# EasyEDA schematic 机创主控拓展板.json
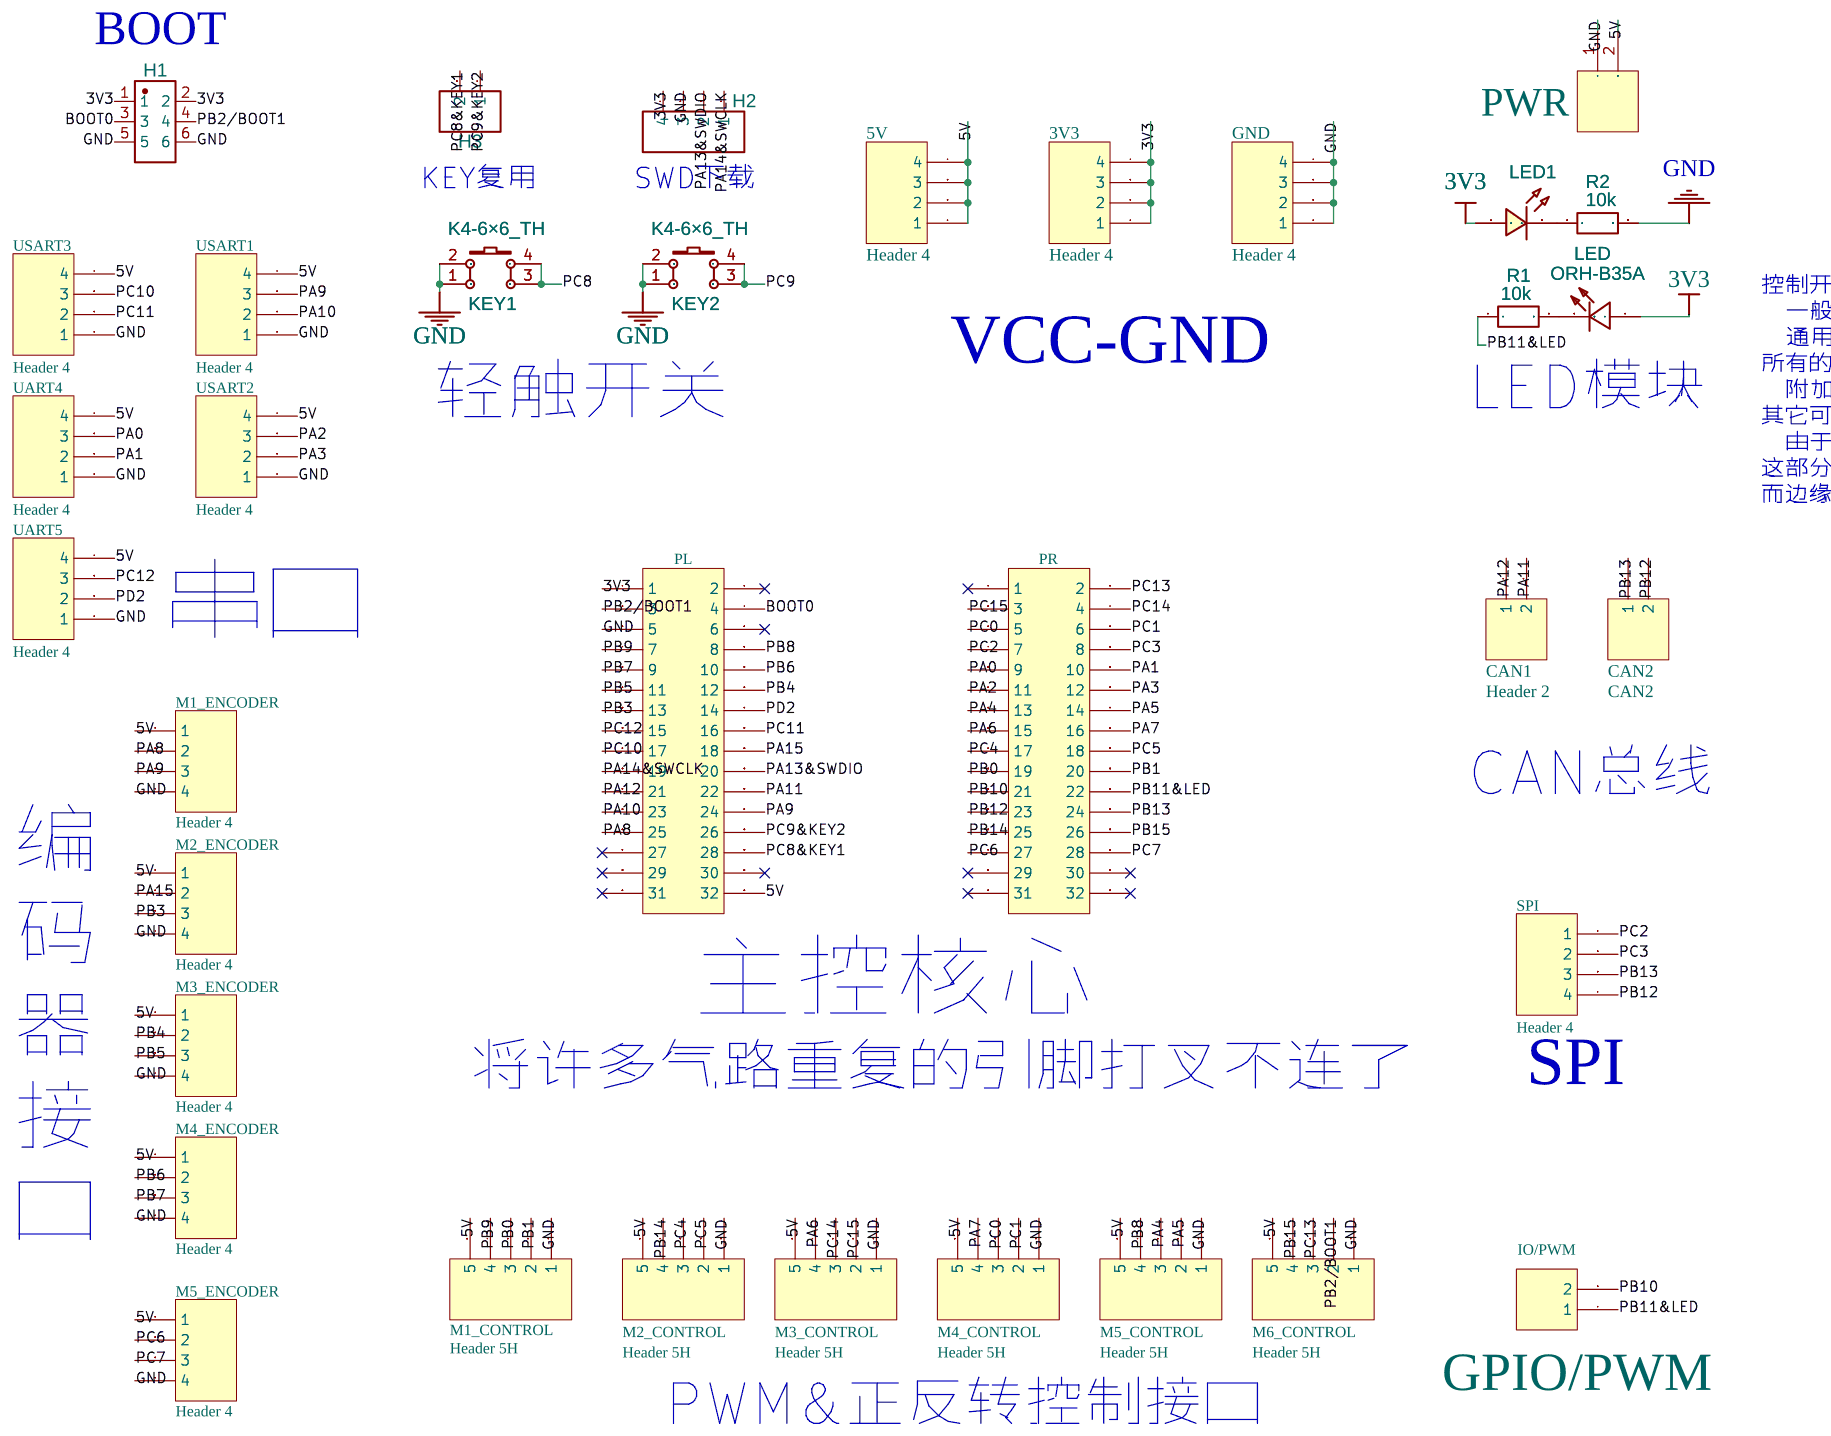
[diagram p0: schematic sheet]

## Parts
3V3  Header 4  [HDR1X4]
5V  Header 4  [HDR1X4]
CAN1  Header 2  [HDR1X2]
CAN2  CAN2  [HDR1X2]
GND  Header 4  [HDR1X4]
H1  PB2为BOOT1设计使用  [HDR-SMD_6P-P2.54-V-M-R2-C3-S2.54-LS7.4]
H2  HDR-F-2.54_1x4  [卧式排针排座]
H3  HDR-F-2.54_1x2  [HDR-F-2.54_1X2]
IO/PWM  GPIO/PWM  [HDR1X2]
KEY1  K4-6×6_TH  [KEY-TH_4P-L6.0-W6.0-P4.50-LS6.5]
KEY2  K4-6×6_TH  [KEY-TH_4P-L6.0-W6.0-P4.50-LS6.5]
LED  ORH-B35A  [LED0805-R-RD]
LED1  LED-0805_R  [LED0805_RED]
M1_CONTROL  Header 5H  [CONN-TH_5P-P2.50_X8821WR-05S-N0SN]
M1_ENCODER  Header 4  [XH2.54-4PW]
M2_CONTROL  Header 5H  [CONN-TH_5P-P2.50_X8821WR-05S-N0SN]
M2_ENCODER  Header 4  [XH2.54-4PW]
M3_CONTROL  Header 5H  [CONN-TH_5P-P2.50_X8821WR-05S-N0SN]
M3_ENCODER  Header 4  [XH2.54-4PW]
M4_CONTROL  Header 5H  [CONN-TH_5P-P2.50_X8821WR-05S-N0SN]
M4_ENCODER  Header 4  [XH2.54-4PW]
M5_CONTROL  Header 5H  [CONN-TH_5P-P2.50_X8821WR-05S-N0SN]
M5_ENCODER  Header 4  [XH2.54-4PW]
M6_CONTROL  Header 5H  [CONN-TH_5P-P2.50_X8821WR-05S-N0SN]
PL  Header 16X2  [HDR2X16]
PR  Header 16X2  [HDR2X16]
PWR  HEADER 2  [CONN-TH_2P-P2.5_XH2.54-2P_H]
R1  10k  [R0805]
R2  10k  [R0805]
SPI  Header 4  [CONN-SMD_GH1.25-4P]
UART4  Header 4  [CONN-SMD_GH1.25-4P]
UART5  Header 4  [CONN-SMD_GH1.25-4P]
USART1  Header 4  [CONN-SMD_GH1.25-4P]
USART2  Header 4  [CONN-SMD_GH1.25-4P]
USART3  Header 4  [CONN-SMD_GH1.25-4P]

## Library data of the parts
3V3 5V CAN1 CAN2 GND IO/PWM M1_CONTROL M1_ENCODER M2_CONTROL M2_ENCODER M3_CONTROL M3_ENCODER M4_CONTROL M4_ENCODER M5_CONTROL M5_ENCODER M6_CONTROL PL PR SPI UART4 UART5 USART1-USART3 = -: LatestRevisionDate: 17-Jul-2002; LatestRevisionNote: Re-released for DXP Platform.; Publisher: Altium Limited
H1 = 双排针2*3P  脚距2.54MM  贴片: Supplier: LCSC; Supplier Part: C77761; Manufacturer: BOOMELE(博穆精密); Manufacturer Part: 双排针2*3P  脚距2.54mm  贴片; Contributor: LCSC; JLCPCB Part Class: Extended Part
H2 = HDR-F-2.54_1x4: Supplier Part: C225501; Supplier: LCSC; Contributor: LCEDA_Lib
H3 = HDR-F-2.54_1x2: Supplier Part: C49661; Supplier: LCSC; Contributor: LCEDA_Lib
KEY1 KEY2 = K4-6×6_TH: Supplier: LCSC; Supplier Part: C136684; Manufacturer: 韩国韩荣; Manufacturer Part: K2-1102DP-E4SW-04; Contributor: LCEDA_Lib
LED = ORH-B35A: Supplier: LCSC; Supplier Part: C205441; Manufacturer: Orient; Contributor: LCSC; JLCPCB Part Class: Extended Part
LED1 = LED-0805_R: Manufacturer: EVERLIGHT(台湾亿光); Manufacturer Part: 17-21SURC/S530-A3/TR8; Supplier Part: C72037; Contributor: LCEDA_Lib
R1 R2 = R_0805_EU: Contributor: LCEDA_Lib

## Nets
3V3: 3V3.1 3V3.2 3V3.3 3V3.4 H1.1 H1.2 H2.4 LED.1(A) LED1.1 PL.1
5V: 5V.1 5V.2 5V.3 5V.4 M1_CONTROL.5 M1_ENCODER.1 M2_CONTROL.5 M2_ENCODER.1 M3_CONTROL.5 M3_ENCODER.1 M4_CONTROL.5 M4_ENCODER.1 M5_CONTROL.5 M5_ENCODER.1 M6_CONTROL.5 PL.32 PWR.2 UART4.4 UART5.4 USART1.4 USART2.4 USART3.4
GND: GND.1 GND.2 GND.3 GND.4 H1.5 H1.6 H2.3 KEY1.1 KEY1.2 KEY2.1 KEY2.2 M1_CONTROL.1 M1_ENCODER.4 M2_CONTROL.1 M2_ENCODER.4 M3_CONTROL.1 M3_ENCODER.4 M4_CONTROL.1 M4_ENCODER.4 M5_CONTROL.1 M5_ENCODER.4 M6_CONTROL.1 PL.5 PWR.1 R2.2 UART4.1 UART5.1 USART1.1 USART2.1 USART3.1
BOOT0: H1.3 PL.4
PA0: PR.9 UART4.3
PA1: PR.10 UART4.2
PA2: PR.11 USART2.3
PA3: PR.12 USART2.2
PA4: M5_CONTROL.3 PR.13
PA5: M5_CONTROL.2 PR.14
PA6: M3_CONTROL.4 PR.15
PA7: M4_CONTROL.4 PR.16
PA8: M1_ENCODER.2 PL.25
PA9: M1_ENCODER.3 PL.24 USART1.3
PA10: PL.23 USART1.2
PA11: CAN1.2 PL.22
PA12: CAN1.1 PL.21
PA13&SWDIO: H2.2 PL.20
PA14&SWCLK: H2.1 PL.19
PA15: M2_ENCODER.2 PL.18
PB0: M1_CONTROL.3 PR.19
PB1: M1_CONTROL.2 PR.20
PB2/BOOT1: H1.4 M6_CONTROL.2 PL.3
PB3: M2_ENCODER.3 PL.13
PB4: M3_ENCODER.2 PL.12
PB5: M3_ENCODER.3 PL.11
PB6: M4_ENCODER.2 PL.10
PB7: M4_ENCODER.3 PL.9
PB8: M5_CONTROL.4 PL.8
PB9: M1_CONTROL.4 PL.7
PB10: IO/PWM.2 PR.21
PB11&LED: IO/PWM.1 PR.22 R1.1
PB12: CAN2.2 PR.23 SPI.4
PB13: CAN2.1 PR.24 SPI.3
PB14: M2_CONTROL.4 PR.25
PB15: M6_CONTROL.4 PR.26
PC0: M4_CONTROL.3 PR.5
PC1: M4_CONTROL.2 PR.6
PC2: PR.7 SPI.1
PC3: PR.8 SPI.2
PC4: M2_CONTROL.3 PR.17
PC5: M2_CONTROL.2 PR.18
PC6: M5_ENCODER.2 PR.27
PC7: M5_ENCODER.3 PR.28
PC8: KEY1.3 KEY1.4
PC8&KEY1: H3.2 PL.28
PC9: KEY2.3 KEY2.4
PC9&KEY2: H3.1 PL.26
PC10: PL.17 USART3.3
PC11: PL.16 USART3.2
PC12: PL.15 UART5.3
PC13: M6_CONTROL.3 PR.2
PC14: M3_CONTROL.3 PR.4
PC15: M3_CONTROL.2 PR.3
PD2: PL.14 UART5.2
Net-(LED1-2): LED1.2 R2.1
Net-(LED-2): LED.2(C) R1.2

Not connected (* = marked no-connect by the designer): PL 2* 6* 27* 29* 30* 31*; PR 1* 29* 30* 31* 32*

## Notes on the sheet
- BOOT
- KEY复用
- SWD下载
- 控制开发板设计原则：
    一般使用两层板，正反面要充分利用。
    通用接口要留全，允许复用接口的存在，只是要对复用接口用特殊的丝印符号标志出来，如*。
  所有的关键均应统一用排针引出（可在开发板背面对称引出，放短接保护后可兼做支撑用）。
    附加元件只保留最主要的，包括LED灯（电源和工作指示，至少两个）、CAN收发器、5V稳压。
  其它可有可无的元件接口不必保留，如NRF、显示屏等专用接口。这样让开发板尽量简洁清晰好维护。
    由于开发板的控制很多情况下是要对诸多电机进行控制，因此要留全电机的接口，包括编码器接口和驱动接口。
  这部分占据大量的接口位置，可以均放置在板子边缘使用卧式插座。
  而边缘位置不够时，其它接口采用立式插座或排针（尽量不用排针）放在板子内部区域。
- VCC-GND
- 轻触开关
- LED模块
- 串口
- CAN总线
- 编
  码
  器
  接
  口
- 主控核心
- 将许多气路重复的引脚打叉不连了
- SPI
- PWM&正反转控制接口
